# Altium schematic sheet MCU.SchDoc
size C; SheetNumber: 2; SheetTotal: 3
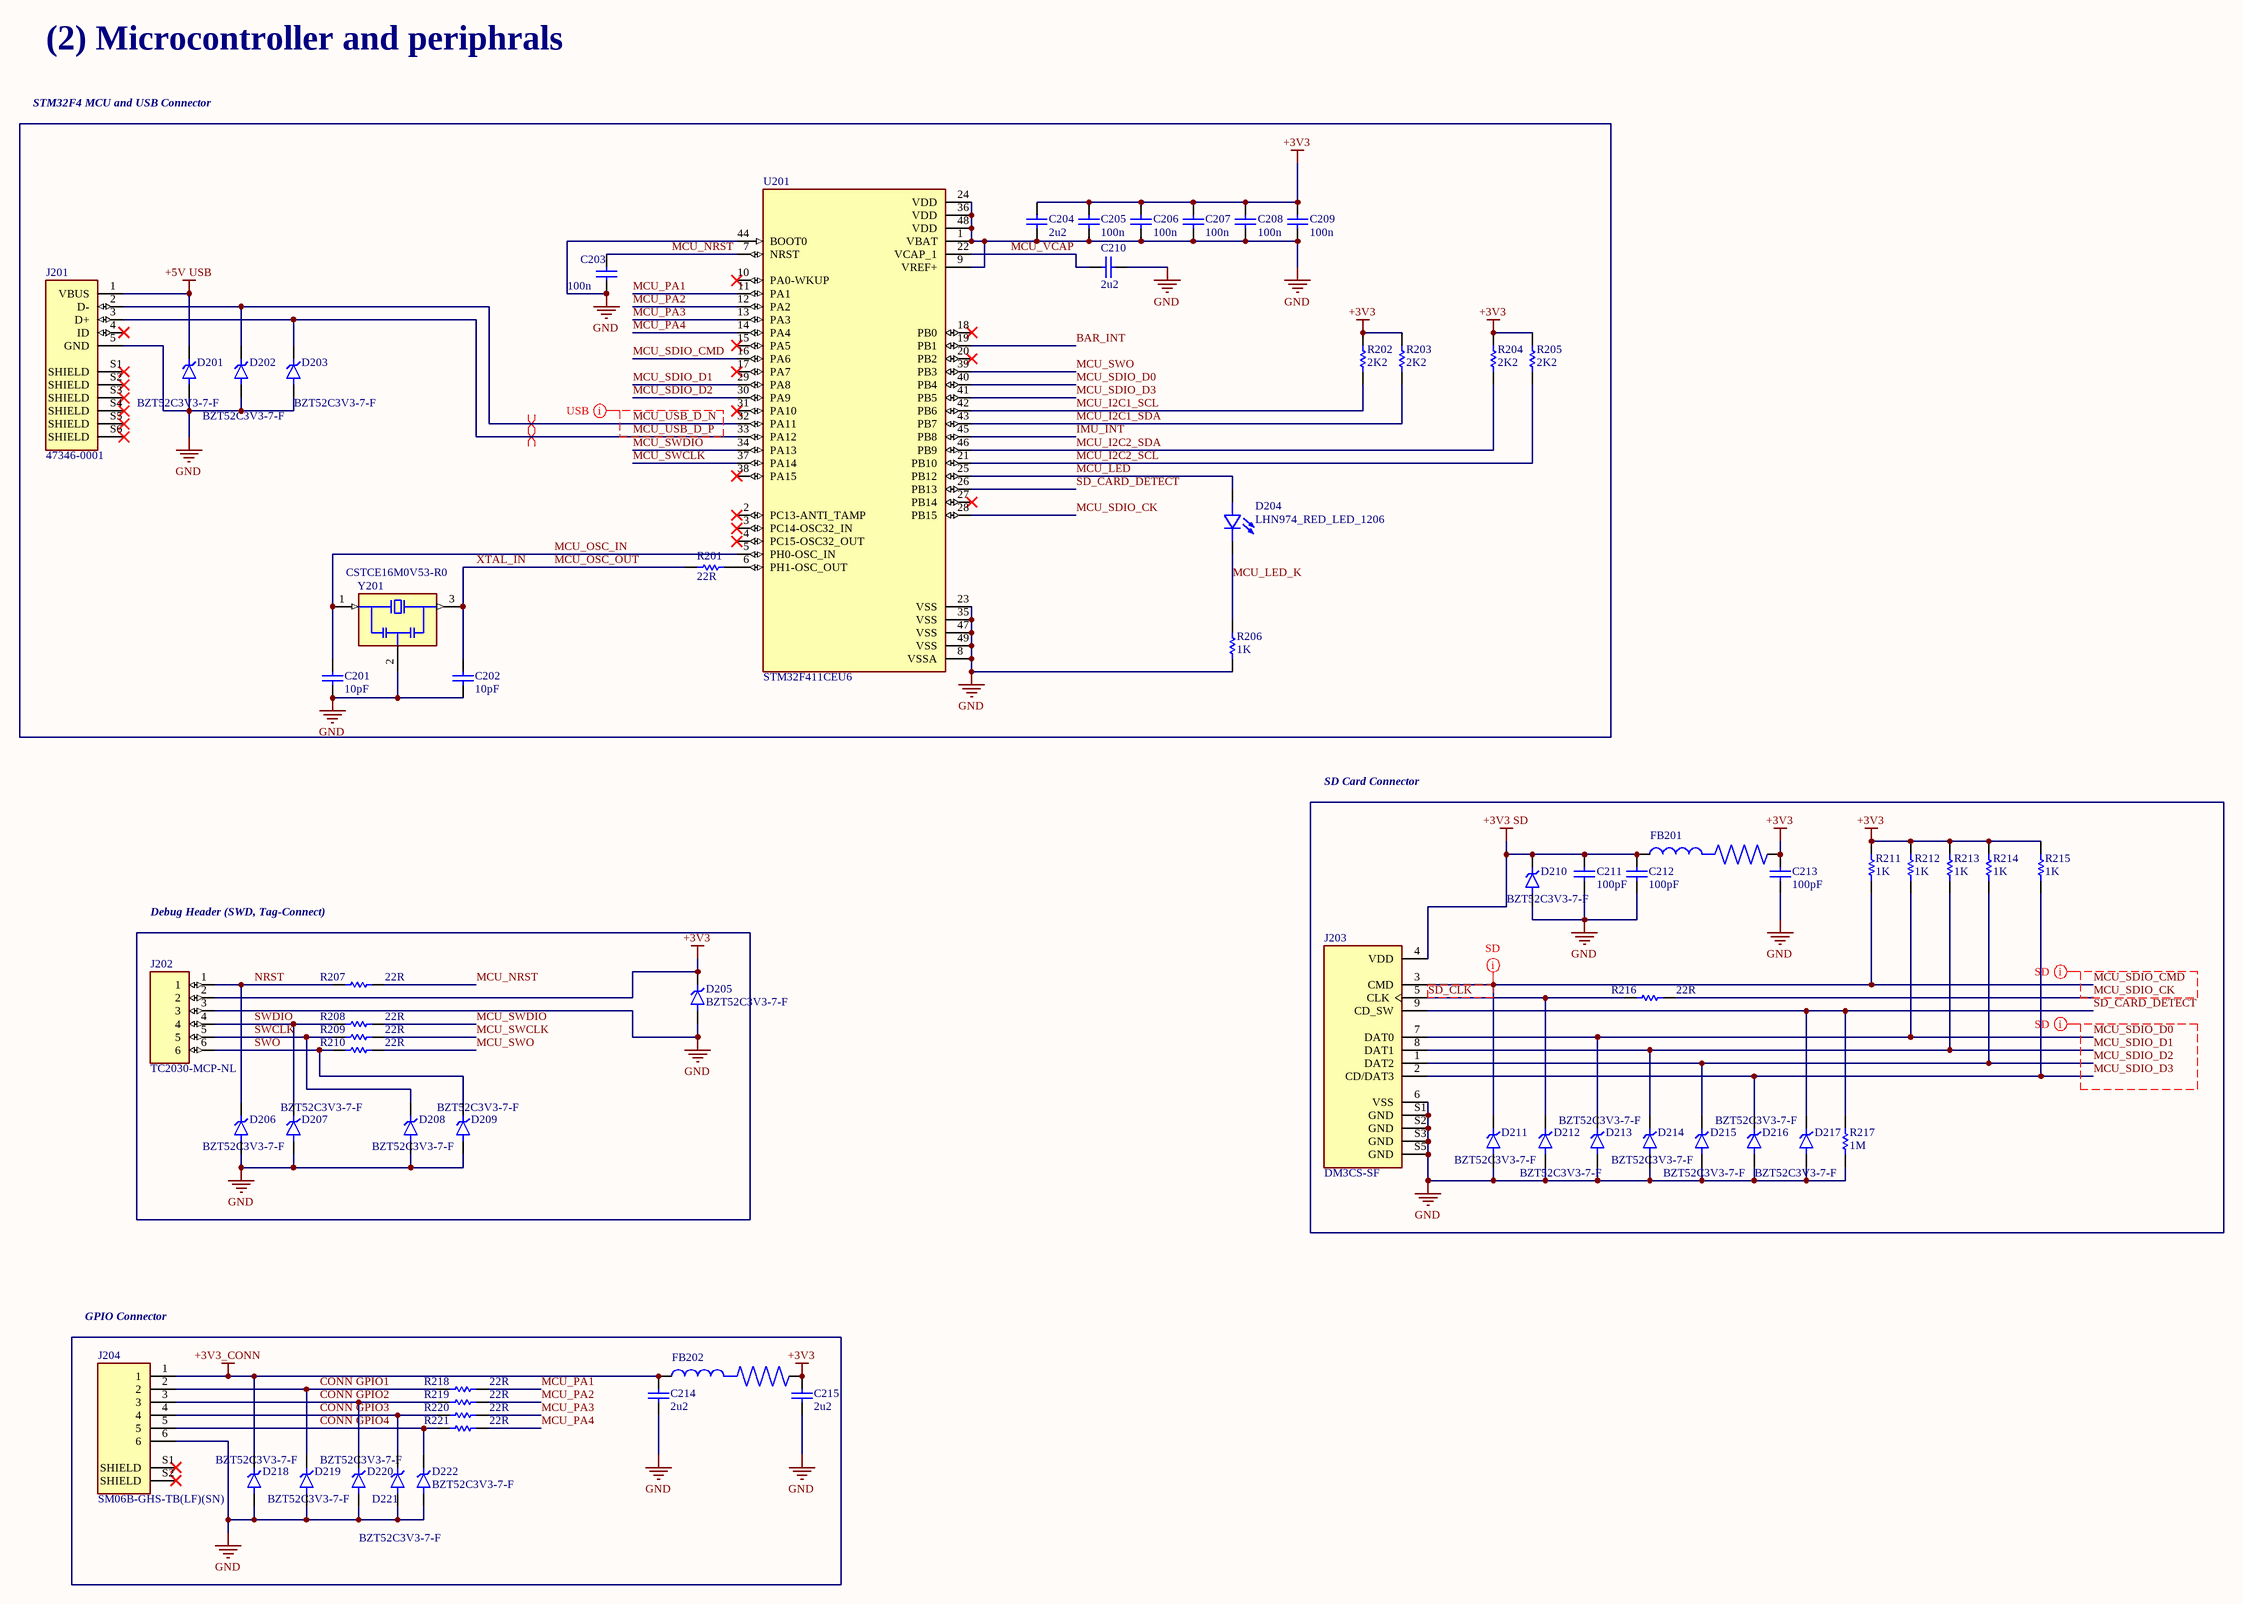
[diagram p0: MCU.SchDoc]

## Parts
C201  value 10pF  [CAP-SM-0805]  (hidden comment: Cap Non-Pol SMD)
C202  value 10pF  [CAP-SM-0805]  (hidden comment: Cap Non-Pol SMD)
C203  value 100n  [CAP-SM-0805]  (hidden comment: Cap Non-Pol SMD)
C204  value 2u2  [CAP-SM-0805]  (hidden comment: Cap Non-Pol SMD)
C205  value 100n  [CAP-SM-0805]  (hidden comment: Cap Non-Pol SMD)
C206  value 100n  [CAP-SM-0805]  (hidden comment: Cap Non-Pol SMD)
C207  value 100n  [CAP-SM-0805]  (hidden comment: Cap Non-Pol SMD)
C208  value 100n  [CAP-SM-0805]  (hidden comment: Cap Non-Pol SMD)
C209  value 100n  [CAP-SM-0805]  (hidden comment: Cap Non-Pol SMD)
C210  value 2u2  [CAP-SM-0805]  (hidden comment: Cap Non-Pol SMD)
C211  value 100pF  [CAP-SM-0805]  (hidden comment: Cap Non-Pol SMD)
C212  value 100pF  [CAP-SM-0805]  (hidden comment: Cap Non-Pol SMD)
C213  value 100pF  [CAP-SM-0805]  (hidden comment: Cap Non-Pol SMD)
C214  value 2u2  [CAP-SM-0805]  (hidden comment: Cap Non-Pol SMD)
C215  value 2u2  [CAP-SM-0805]  (hidden comment: Cap Non-Pol SMD)
D201  BZT52C3V3-7-F  [SOD3715X135N]
D202  BZT52C3V3-7-F  [SOD3715X135N]
D203  BZT52C3V3-7-F  [SOD3715X135N]
D204  LHN974_RED_LED_1206  [LEDC3216X120N]
D205  BZT52C3V3-7-F  [SOD3715X135N]
D206  BZT52C3V3-7-F  [SOD3715X135N]
D207  BZT52C3V3-7-F  [SOD3715X135N]
D208  BZT52C3V3-7-F  [SOD3715X135N]
D209  BZT52C3V3-7-F  [SOD3715X135N]
D210  BZT52C3V3-7-F  [SOD3715X135N]
D211  BZT52C3V3-7-F  [SOD3715X135N]
D212  BZT52C3V3-7-F  [SOD3715X135N]
D213  BZT52C3V3-7-F  [SOD3715X135N]
D214  BZT52C3V3-7-F  [SOD3715X135N]
D215  BZT52C3V3-7-F  [SOD3715X135N]
D216  BZT52C3V3-7-F  [SOD3715X135N]
D217  BZT52C3V3-7-F  [SOD3715X135N]
D218  BZT52C3V3-7-F  [SOD3715X135N]
D219  BZT52C3V3-7-F  [SOD3715X135N]
D220  BZT52C3V3-7-F  [SOD3715X135N]
D221  BZT52C3V3-7-F  [SOD3715X135N]
D222  BZT52C3V3-7-F  [SOD3715X135N]
FB201  (no value)  [BEADC0603X33N]
FB202  (no value)  [BEADC0603X33N]
J201  47346-0001  [MOLEX_47346-0001]
J202  TC2030-MCP-NL  [TC2030-MCP-NL]
J203  DM3CS-SF  [HRS_DM3CS-SF]
J204  SM06B-GHS-TB(LF)(SN)  [JST_SM06B-GHS-TB(LF)(SN)]
R201  value 22R  [RES-SM-0603]  (hidden comment: RESISTOR SMD)
R202  value 2K2  [RES-SM-0603]  (hidden comment: RESISTOR SMD)
R203  value 2K2  [RES-SM-0603]  (hidden comment: RESISTOR SMD)
R204  value 2K2  [RES-SM-0603]  (hidden comment: RESISTOR SMD)
R205  value 2K2  [RES-SM-0603]  (hidden comment: RESISTOR SMD)
R206  value 1K  [RES-SM-0603]  (hidden comment: RESISTOR SMD)
R207  value 22R  [RES-SM-0603]  (hidden comment: RESISTOR SMD)
R208  value 22R  [RES-SM-0603]  (hidden comment: RESISTOR SMD)
R209  value 22R  [RES-SM-0603]  (hidden comment: RESISTOR SMD)
R210  value 22R  [RES-SM-0603]  (hidden comment: RESISTOR SMD)
R211  10K: 1K  [RES-SM-0603]  (hidden comment: RESISTOR SMD)
R212  10K: 1K  [RES-SM-0603]  (hidden comment: RESISTOR SMD)
R213  10K: 1K  [RES-SM-0603]  (hidden comment: RESISTOR SMD)
R214  10K: 1K  [RES-SM-0603]  (hidden comment: RESISTOR SMD)
R215  10K: 1K  [RES-SM-0603]  (hidden comment: RESISTOR SMD)
R216  R216: 22R  [RES-SM-0603]  (hidden comment: RESISTOR SMD)
R217  value 1M  [RES-SM-0603]  (hidden comment: RESISTOR SMD)
R218  value 22R  [RES-SM-0603]  (hidden comment: RESISTOR SMD)
R219  value 22R  [RES-SM-0603]  (hidden comment: RESISTOR SMD)
R220  value 22R  [RES-SM-0603]  (hidden comment: RESISTOR SMD)
R221  value 22R  [RES-SM-0603]  (hidden comment: RESISTOR SMD)
U201  STM32F411CEU6  [QFN50P700X700X60-49N]
Y201  CSTCE16M0V53-R0  [OSC_CSTCE16M0V53-R0]

## Nets
+3V3: C204.2 C205.2 C206.2 C207.2 C208.2 C209.2 C213.2 C215.2 D205.K FB201.2 FB202.2 J202.2 R202.2 R203.2 R204.2 R205.2 R211.2 R212.2 R213.2 R214.2 R215.2
+3V3 SD: C211.2 C212.2 D210.K FB201.1 J203.4(VDD)
+3V3_CONN: C214.2 D218.K FB202.1 J204.1
+5V USB: D201.K J201.1(VBUS)
GND: C201.1 C202.1 C203.1 C204.1 C205.1 C206.1 C207.1 C208.1 C209.1 C210.1 C211.1 C212.1 C213.1 C214.1 C215.1 D201.A D202.A D203.A D205.A D206.A D207.A D208.A D209.A D210.A D211.A D212.A D213.A D214.A D215.A D216.A D217.A D218.A D219.A D220.A D221.A D222.A J201.5(GND) J202.3 J203.6(VSS) J203.S1(GND) J203.S2(GND) J203.S3(GND) J203.S5(GND) J204.6 R206.1 R217.1 U201.1(VBAT) U201.8(VSSA) U201.9(VREF+) U201.23(VSS) U201.24(VDD) U201.35(VSS) U201.36(VDD) U201.44(BOOT0) U201.47(VSS) U201.48(VDD) U201.49(VSS) Y201.2(GND)
BAR_INT: U201.19(PB1)
CONN GPIO1: D219.K J204.2 R218.2
CONN GPIO2: D220.K J204.3 R219.2
CONN GPIO3: D221.K J204.4 R220.2
CONN GPIO4: D222.K J204.5 R221.2
IMU_INT: U201.45(PB8)
MCU_I2C1_SCL: R202.1 U201.42(PB6)
MCU_I2C1_SDA: R203.1 U201.43(PB7)
MCU_I2C2_SCL: R205.1 U201.21(PB10)
MCU_I2C2_SDA: R204.1 U201.46(PB9)
MCU_LED: D204.POS U201.25(PB12)
MCU_LED_K: D204.NEG R206.2
MCU_NRST: C203.2 R207.1 U201.7(NRST)
MCU_OSC_IN: C201.2 U201.5(PH0-OSC_IN) Y201.1(IN)
MCU_OSC_OUT: C202.2 R201.2 Y201.3(OUT)  [also labelled XTAL_IN]
MCU_PA1: R218.1 U201.11(PA1)
MCU_PA2: R219.1 U201.12(PA2)
MCU_PA3: R220.1 U201.13(PA3)
MCU_PA4: R221.1 U201.14(PA4)
MCU_SDIO_CK: R216.1 U201.28(PB15)
MCU_SDIO_CMD: D211.K J203.3(CMD) R211.1 U201.16(PA6)
MCU_SDIO_D0: D213.K J203.7(DAT0) R212.1 U201.40(PB4)
MCU_SDIO_D1: D214.K J203.8(DAT1) R213.1 U201.29(PA8)
MCU_SDIO_D2: D215.K J203.1(DAT2) R214.1 U201.30(PA9)
MCU_SDIO_D3: D216.K J203.2(CD/DAT3) R215.1 U201.41(PB5)
MCU_SWCLK: R209.1 U201.37(PA14)
MCU_SWDIO: R208.1 U201.34(PA13)
MCU_SWO: R210.1 U201.39(PB3)
MCU_USB_D_N: D202.K J201.2(D-) U201.32(PA11)
MCU_USB_D_P: D203.K J201.3(D+) U201.33(PA12)
MCU_VCAP: C210.2 U201.22(VCAP_1)
NRST: D206.K J202.1 R207.2
SD_CARD_DETECT: D217.K J203.9(CD_SW) R217.2 U201.26(PB13)
SD_CLK: D212.K J203.5(CLK) R216.2
SWCLK: D208.K J202.5 R209.2
SWDIO: D207.K J202.4 R208.2
SWO: D209.K J202.6 R210.2
NetR201_1: R201.1 U201.6(PH1-OSC_OUT)

Not connected (* = marked no-connect by the designer): J201 4(ID)* S1(SHIELD)* S2(SHIELD)* S3(SHIELD)* S4(SHIELD)* S5(SHIELD)* S6(SHIELD)*; J204 S1(SHIELD)* S2(SHIELD)*; U201 2(PC13-ANTI_TAMP)* 3(PC14-OSC32_IN)* 4(PC15-OSC32_OUT)* 10(PA0-WKUP)* 15(PA5)* 17(PA7)* 18(PB0)* 20(PB2)* 27(PB14)* 31(PA10)* 38(PA15)*

## Layout directives
differential pair: MCU_USB_D_N, MCU_USB_D_P
mark named USB: MCU_USB_D_N, MCU_USB_D_P
mark named SD: MCU_SDIO_CK, MCU_SDIO_CMD, MCU_SDIO_D0, MCU_SDIO_D1, MCU_SDIO_D2, MCU_SDIO_D3

## Notes on the sheet
- (2) Microcontroller and periphrals
- STM32F4 MCU and USB Connector
- SD Card Connector
- Debug Header (SWD, Tag-Connect)
- GPIO Connector

## Library data of the parts
C201-C215 = Cap Non-Pol SMD: Capacitor
D201-D203 D205-D222 = BZT52C3V3-7-F: Diode Zener 3.3V 6% 500mW 2Pin SOD123 | Diodes Inc BZT52C3V3-7-F; MF: Diodes Inc.; SnapEDA_Link: https://www.snapeda.com/parts/BZT52C3V3-7-F/Diodes+Inc./view-part/?ref=snap; Package: SOD-123 Fairchild Semiconductor; Value: *; MP: BZT52C3V3-7-F; Check_prices: https://www.snapeda.com/parts/BZT52C3V3-7-F/Diodes+Inc./view-part/?ref=eda
D204 = LHN974_RED_LED_1206: 2.6 V Red LED SMD; MF: Osram; MP: LHN974 RED LED 1206; SnapEDA_Link: https://www.snapeda.com/parts/LHN974%20RED%20LED%201206/Osram/view-part/?ref=snap; Package: None; Value: *; Check_prices: https://www.snapeda.com/parts/LHN974%20RED%20LED%201206/Osram/view-part/?ref=eda
FB201 FB202 = BLM03HD331SZ1D: Ferrite Bead; MF: Murata; SnapEDA_Link: https://www.snapeda.com/parts/BLM03HD331SZ1D/Murata/view-part/?ref=snap; Package: 0603 Murata; Value: *; MP: BLM03HD331SZ1D; Check_prices: https://www.snapeda.com/parts/BLM03HD331SZ1D/Murata/view-part/?ref=eda
J201 = 47346-0001: Conn Data USB Micro B w/Flange SMT Bottom Mnt LF | Molex Incorporated 47346-0001; SnapEDA_Link: https://www.snapeda.com/parts/47346-0001/Molex/view-part/?ref=snap; Package: None; Value: *; MF: Molex; MP: 47346-0001; Check_prices: https://www.snapeda.com/parts/47346-0001/Molex/view-part/?ref=eda
J202 = TC2030-MCP-NL: MPLABÂ® REAL ICE, ICD 3, PICkit 3, PICkit 2 Plug-Of-Nailsâ„¢ Adapter Cable; MF: Tag-Connect LLC; SnapEDA_Link: https://www.snapeda.com/parts/TC2030-MCP-NL/Tag-Connect/view-part/?ref=snap; Package: None; Value: *; MP: TC2030-MCP-NL; Check_prices: https://www.snapeda.com/parts/TC2030-MCP-NL/Tag-Connect/view-part/?ref=eda
J203 = DM3CS-SF: 10 (8 + 2) Position Card Connector Secure Digital - microSDâ„¢ Surface Mount, Right Angle Gold; MF: Hirose Electric Co Ltd; SnapEDA_Link: https://www.snapeda.com/parts/DM3CS-SF/Hirose+Electric+Co+Ltd/view-part/?ref=snap; Package: None; Value: *; MP: DM3CS-SF; Check_prices: https://www.snapeda.com/parts/DM3CS-SF/Hirose+Electric+Co+Ltd/view-part/?ref=eda
J204 = SM06B-GHS-TB(LF)(SN): Connector Header Surface Mount, Right Angle 6 position 0.049 (1.25mm); MF: JST Sales; MP: SM06B-GHS-TB(LF)(SN)-; SnapEDA_Link: https://www.snapeda.com/parts/SM06B-GHS-TB(LF)(SN)-/JST/view-part/?ref=snap; Package: None; Value: *; Check_prices: https://www.snapeda.com/parts/SM06B-GHS-TB(LF)(SN)-/JST/view-part/?ref=eda
R201-R221 = RESISTOR SMD: Resistor
U201 = STM32F411CEU6: High-performance access line, ARM Cortex-M4 core with DSP and FPU, 512 Kbytes Flash, 100 MHz CPU, ART Accelerator; Package: None; Availability: Unavailable; Value: *; MP: STM32F411CEU6; Price: None
Y201 = CSTCE16M0V53-R0: 16 MHz Ceramic Resonator Built in Capacitor 15 pF Â±0.3% -20Â°C ~ 80Â°C Surface Mount; MF: Murata; MP: CSTCE16M0V53-R0-; SnapEDA_Link: https://www.snapeda.com/parts/CSTCE16M0V53-R0-/Murata/view-part/?ref=snap; Package: None; Value: *; Check_prices: https://www.snapeda.com/parts/CSTCE16M0V53-R0-/Murata/view-part/?ref=eda